# Altium schematic sheet Output_Stage.SchDoc
size A4; SheetNumber: 5; SheetTotal: 6
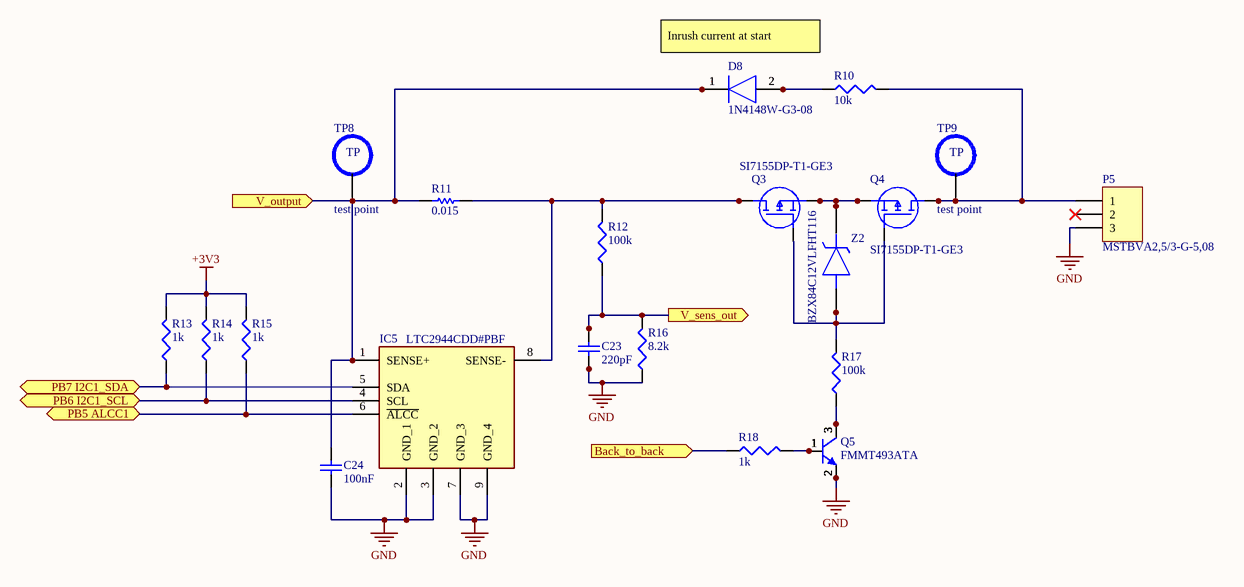
[diagram p0: Output_Stage.SchDoc]

## Parts
C23  220pF  [CAPC3216X180N]
C24  value 100nF  [CAPC3216X180N]  (hidden comment: CC1206KKX7R0BB104)
D8  1N4148W-G3-08  [SOD3716X135N]
IC5  LTC2944CDD#PBF  [SON50P300X300X80-9N-D]
P5  MSTBVA2,5/3-G-5,08  [HDR1X3]
Q3  SI7155DP-T1-GE3  [SI7141DPT1GE3]
Q4  SI7155DP-T1-GE3  [SI7141DPT1GE3]
Q5  FMMT493ATA  [SOT95P230X110-3N]
R10  value 10k  [RESC3216X75N]  (hidden comment: MCWR12X1002FTL)
R11  value 0.015  [RESC3216X75N]  (hidden comment: ERJ8BWFR015V)
R12  value 100k  [RESC3216X75N]  (hidden comment: 100KΩ)
R13  value 1k  [RESC3216X75N]  (hidden comment: MCHP06W2F1001T5E)
R14  value 1k  [RESC3216X75N]  (hidden comment: MCHP06W2F1001T5E)
R15  value 1k  [RESC3216X75N]  (hidden comment: MCHP06W2F1001T5E)
R16  value 8.2k  [RESC3216X75N]  (hidden comment: 8.2KΩ)
R17  value 100k  [RESC3216X75N]  (hidden comment: MCWR12X1003FTL)
R18  value 1k  [RESC3216X75N]  (hidden comment: MCHP06W2F1001T5E)
TP8  test point  [Test point]
TP9  test point  [Test point]
Z2  BZX84C12VLFHT116  [SOT95P240X115-3N]

## Ports
Back_to_back (in), PB5 ALCC1 (bidir), PB6 I2C1_SCL (bidir), PB7 I2C1_SDA (bidir), V_output (in), V_sens_out (out)

## Nets
+3V3: R13.2 R14.2 R15.2
GND: C23.1 C24.1 IC5.2(GND_1) IC5.3(GND_2) IC5.7(GND_3) IC5.9(GND_4) P5.3 Q5.2(E) R16.1
Back_to_back: R18.1 ; port Back_to_back
PB5 ALCC1: IC5.6(~{ALCC}) R15.1 ; port PB5 ALCC1
PB6 I2C1_SCL: IC5.4(SCL) R14.1 ; port PB6 I2C1_SCL
PB7 I2C1_SDA: IC5.5(SDA) R13.1 ; port PB7 I2C1_SDA
V_output: C24.2 D8.1(K) IC5.1(SENSE+) R11.1 TP8.5 ; port V_output
V_sens_out: C23.2 R12.1 R16.2 ; port V_sens_out
NetD8_2: D8.2(A) R10.1
NetIC5_8: IC5.8(SENSE-) Q3.5(D) Q3.6(D) Q3.7(D) Q3.8(D) R11.2 R12.2
NetP5_1: P5.1 Q4.5(D) Q4.6(D) Q4.7(D) Q4.8(D) R10.2 TP9.5
NetQ3_1: Q3.1(G) Q4.1(G) R17.2 Z2.1(A) Z2.2(A)
NetQ3_2: Q3.2(S) Q3.3(S) Q3.4(S) Q4.2(S) Q4.3(S) Q4.4(S) Z2.3(K)
NetQ5_1: Q5.1(B) R18.2
NetQ5_3: Q5.3(C) R17.1

Not connected (* = marked no-connect by the designer): P5 2*

## Notes on the sheet
- Inrush current at start
- (in symbol test point) TP

## Library data of the parts
C23 = VJ1206A221JXBCW1BC: Capacitor 220pF; Published: 8-Jun-2000; LatestRevisionDate: 17-Jul-2002; LatestRevisionNote: Re-released for DXP Platform.; PackageReference: RAD-0.3; Publisher: Altium Limited; PackageDescription: Radial Cap, Thru-Hole; 2 Leads; 0.3 in Pin Spacing; Supplier 1: Mouser; Value: 220pF
C24 = CC1206KKX7R0BB104: Capacitor 100nF; Published: 8-Jun-2000; LatestRevisionDate: 17-Jul-2002; LatestRevisionNote: Re-released for DXP Platform.; PackageReference: RAD-0.3; Publisher: Altium Limited; PackageDescription: Radial Cap, Thru-Hole; 2 Leads; 0.3 in Pin Spacing; Supplier 1: Farnell
D8 = 1N4148W-G3-08: Diode; Manufacturer_Name: Vishay; Datasheet Link: https://componentsearchengine.com/Datasheets/1/1N4148W-G3-08.pdf; Height: 1.35mm; Manufacturer_Part_Number: 1N4148W-G3-08; Mouser Part Number: 78-1N4148W-G3-08; Mouser Price/Stock: https://www.mouser.co.uk/ProductDetail/Vishay-Semiconductors/1N4148W-G3-08?qs=uS%252BVSIFnvp46StDBB15x4Q%3D%3D; Arrow Part Number: 1N4148W-G3-08; Arrow Price/Stock: https://www.arrow.com/en/products/1n4148w-g3-08/vishay
IC5 = LTC2944CDD#PBF: Integrated Circuit; Manufacturer_Name: Analog Devices; Datasheet Link: https://www.analog.com/media/en/technical-documentation/data-sheets/2944fa.pdf; Height: 0.8mm; Manufacturer_Part_Number: LTC2944CDD#PBF; Mouser Part Number: 584-LTC2944CDDPBF; Mouser Price/Stock: https://www.mouser.co.uk/ProductDetail/Analog-Devices/LTC2944CDDPBF?qs=u4fy%2FsgLU9Omd44j%252B6inEQ%3D%3D; Arrow Part Number: LTC2944CDD#PBF; Arrow Price/Stock: https://www.arrow.com/en/products/ltc2944cddpbf/analog-devices
P5 = MSTBVA2,5/3-G-5,08: Header, 3-Pin; LatestRevisionDate: 17-Jul-2002; LatestRevisionNote: Re-released for DXP Platform.; Publisher: Altium Limited
Q3 Q4 = SI7155DP-T1-GE3: MOSFET (P-Channel)
Q5 = FMMT493ATA: Transistor BJT PNP; Manufacturer_Name: Diodes Inc.; Datasheet Link: https://datasheet.datasheetarchive.com/originals/distributors/Datasheets_SAMA/813f9dcbae48594177f25ecf9038d058.pdf; Height: 1.1mm; Manufacturer_Part_Number: FMMT493ATA; Mouser Part Number: 522-FMMT493ATA; Mouser Price/Stock: https://www.mouser.co.uk/ProductDetail/Diodes-Incorporated/FMMT493ATA?qs=GBLSl2AkiruoD9OMdIH%252BaQ%3D%3D; Arrow Part Number: FMMT493ATA; Arrow Price/Stock: https://www.arrow.com/en/products/fmmt493ata/diodes-incorporated
R10 = MCWR12X1002FTL: Resistor 10k; Published: 8-Jun-2000; LatestRevisionDate: 29-May-2009; LatestRevisionNote: IPC-7351 Footprint Added.; PackageReference: J1-0603; Publisher: Altium Limited; PackageDescription: Chip Resistor; Supplier 1: Farnell
R11 = ERJ8BWFR015V: Shunt resistor 0.015; Published: 8-Jun-2000; LatestRevisionDate: 17-Jul-2002; LatestRevisionNote: Re-released for DXP Platform.; PackageReference: AXIAL-0.3; Publisher: Altium Limited; PackageDescription: Axial Device, Thru-Hole; 2 Leads; 0.3 in Pin Spacing; Supplier 1: Mouser
R12 R17 = MCWR12X1003FTL: Resistor 100k; Published: 8-Jun-2000; LatestRevisionDate: 29-May-2009; LatestRevisionNote: IPC-7351 Footprint Added.; PackageReference: J1-0603; Publisher: Altium Limited; PackageDescription: Chip Resistor; Supplier 1: Farnell
R13-R15 R18 = MCHP06W2F1001T5E: Resistor 1k; Published: 8-Jun-2000; LatestRevisionDate: 29-May-2009; LatestRevisionNote: IPC-7351 Footprint Added.; PackageReference: J1-0603; Publisher: Altium Limited; PackageDescription: Chip Resistor; supplier: farnell; Supplier 1: Farnell
R16 = CRGCQ1206F8K2: Resistor 8.2k; Published: 8-Jun-2000; LatestRevisionDate: 29-May-2009; LatestRevisionNote: IPC-7351 Footprint Added.; PackageReference: J1-0603; Publisher: Altium Limited; PackageDescription: Chip Resistor; Supplier 1: Mouser
Z2 = BZX84C12VLFHT116: Zener Diode